# EAGLE board Main (EAGLE 8.7.0), part 1 of 2
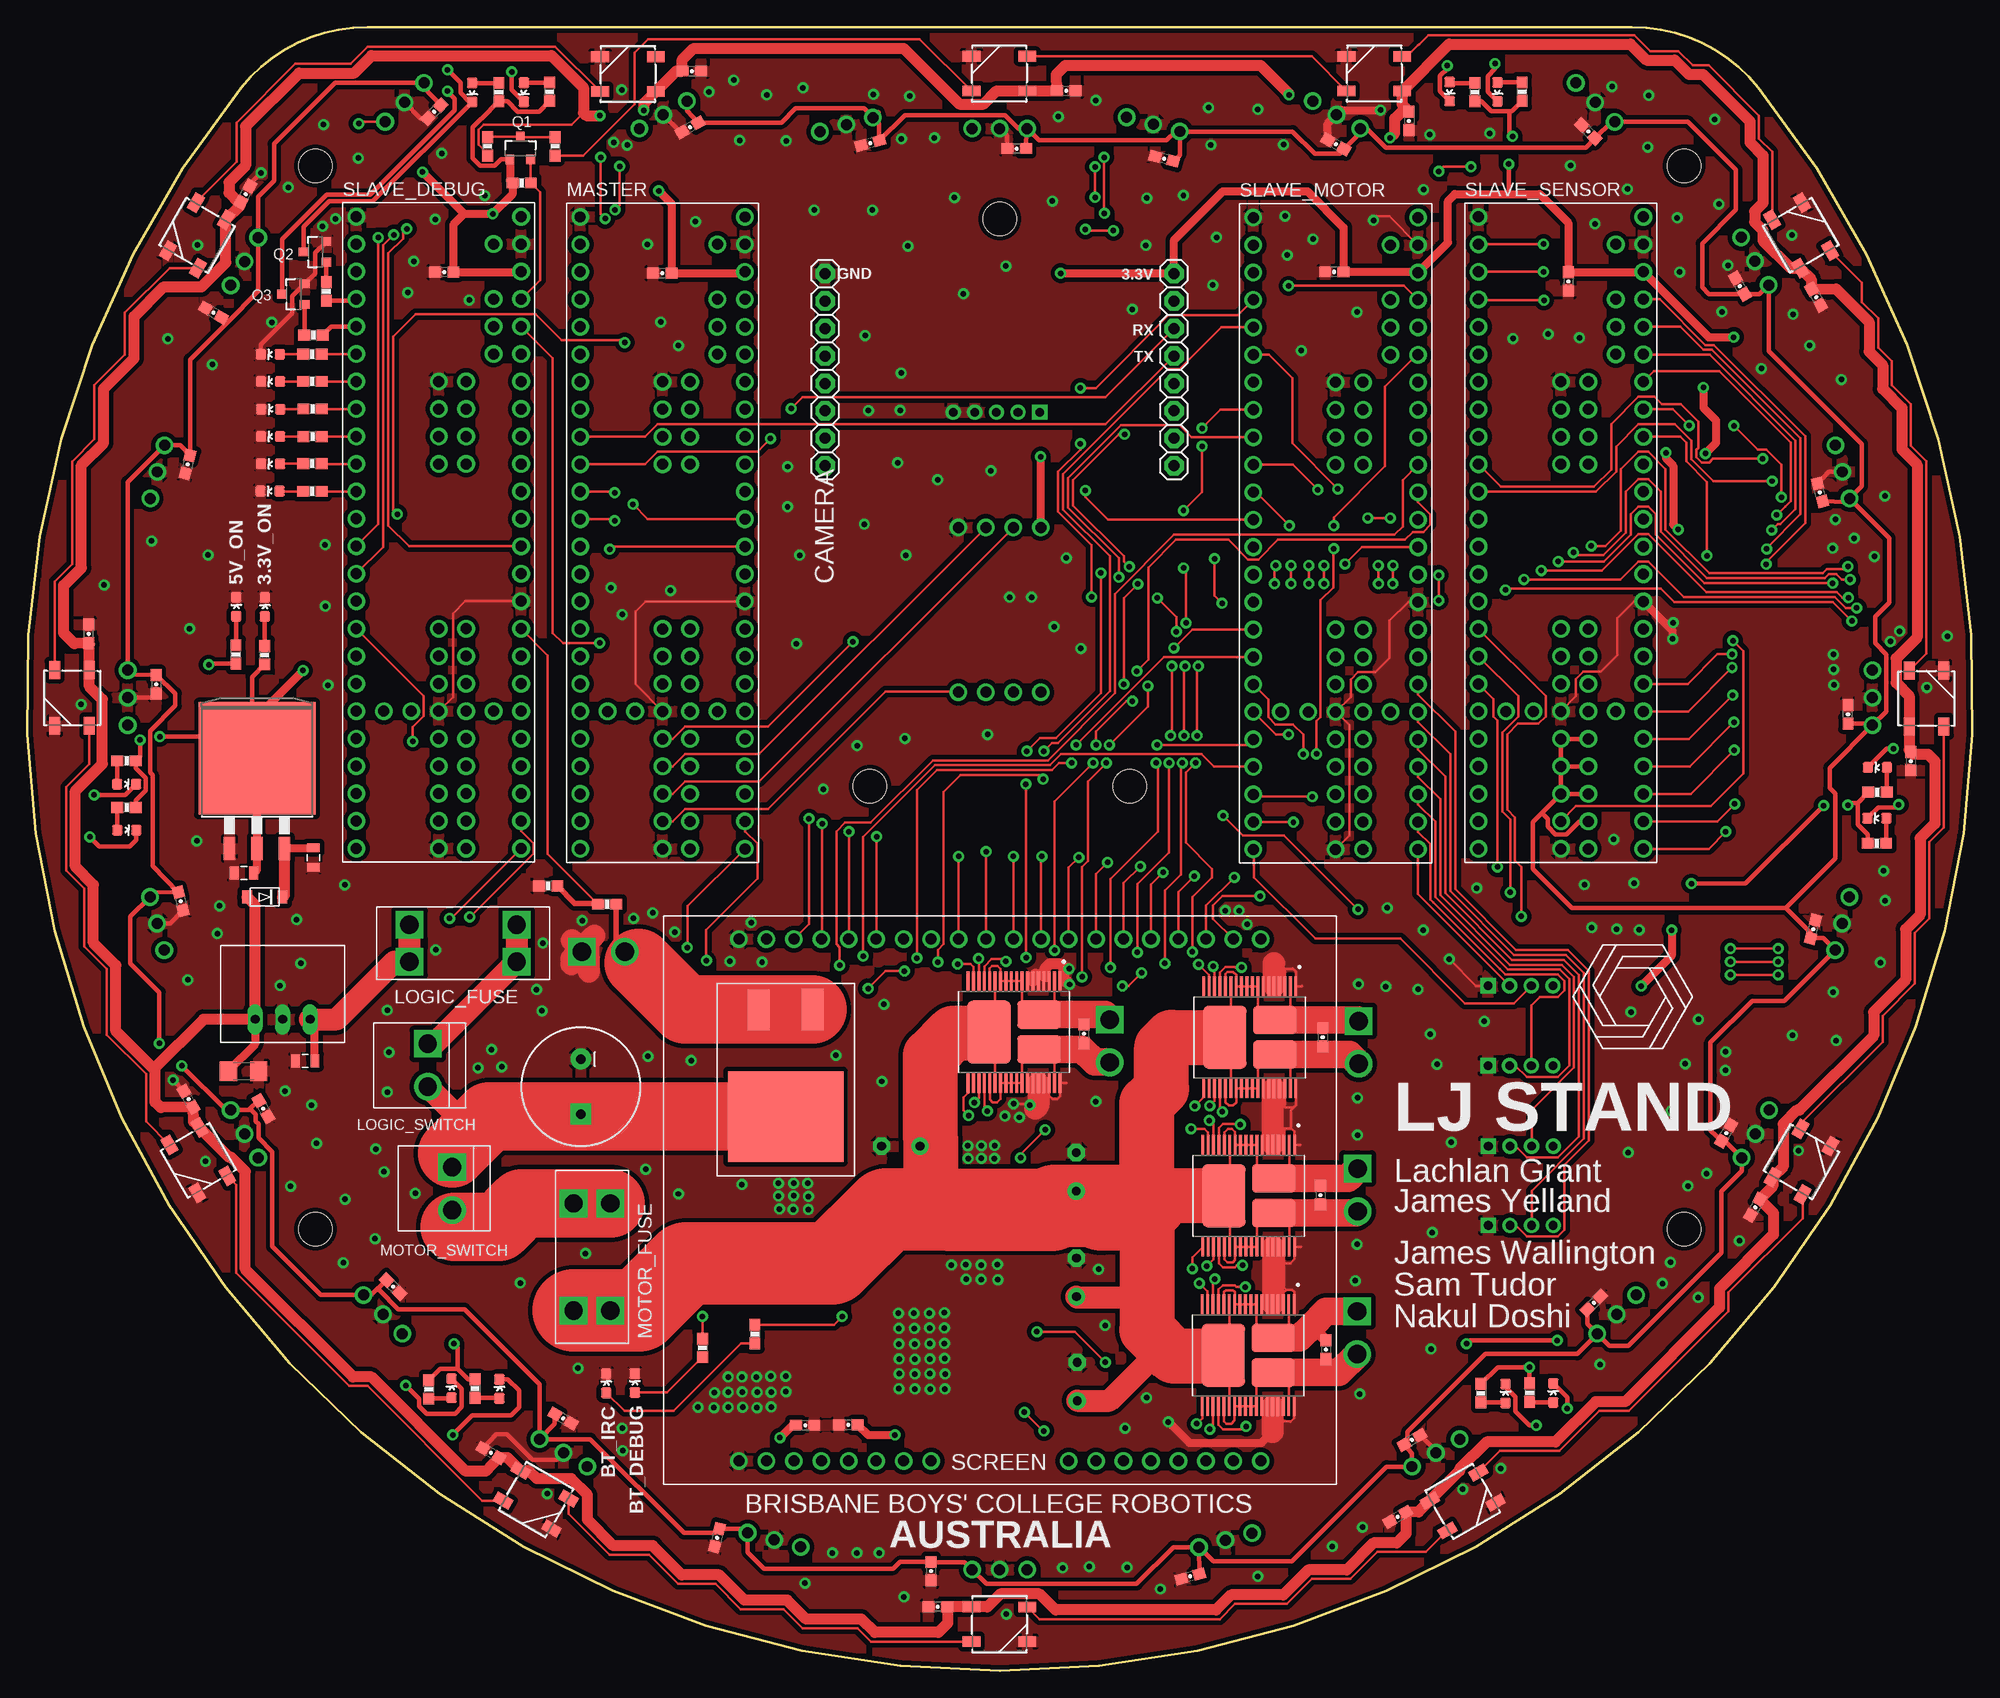
[diagram p5: board, top side]
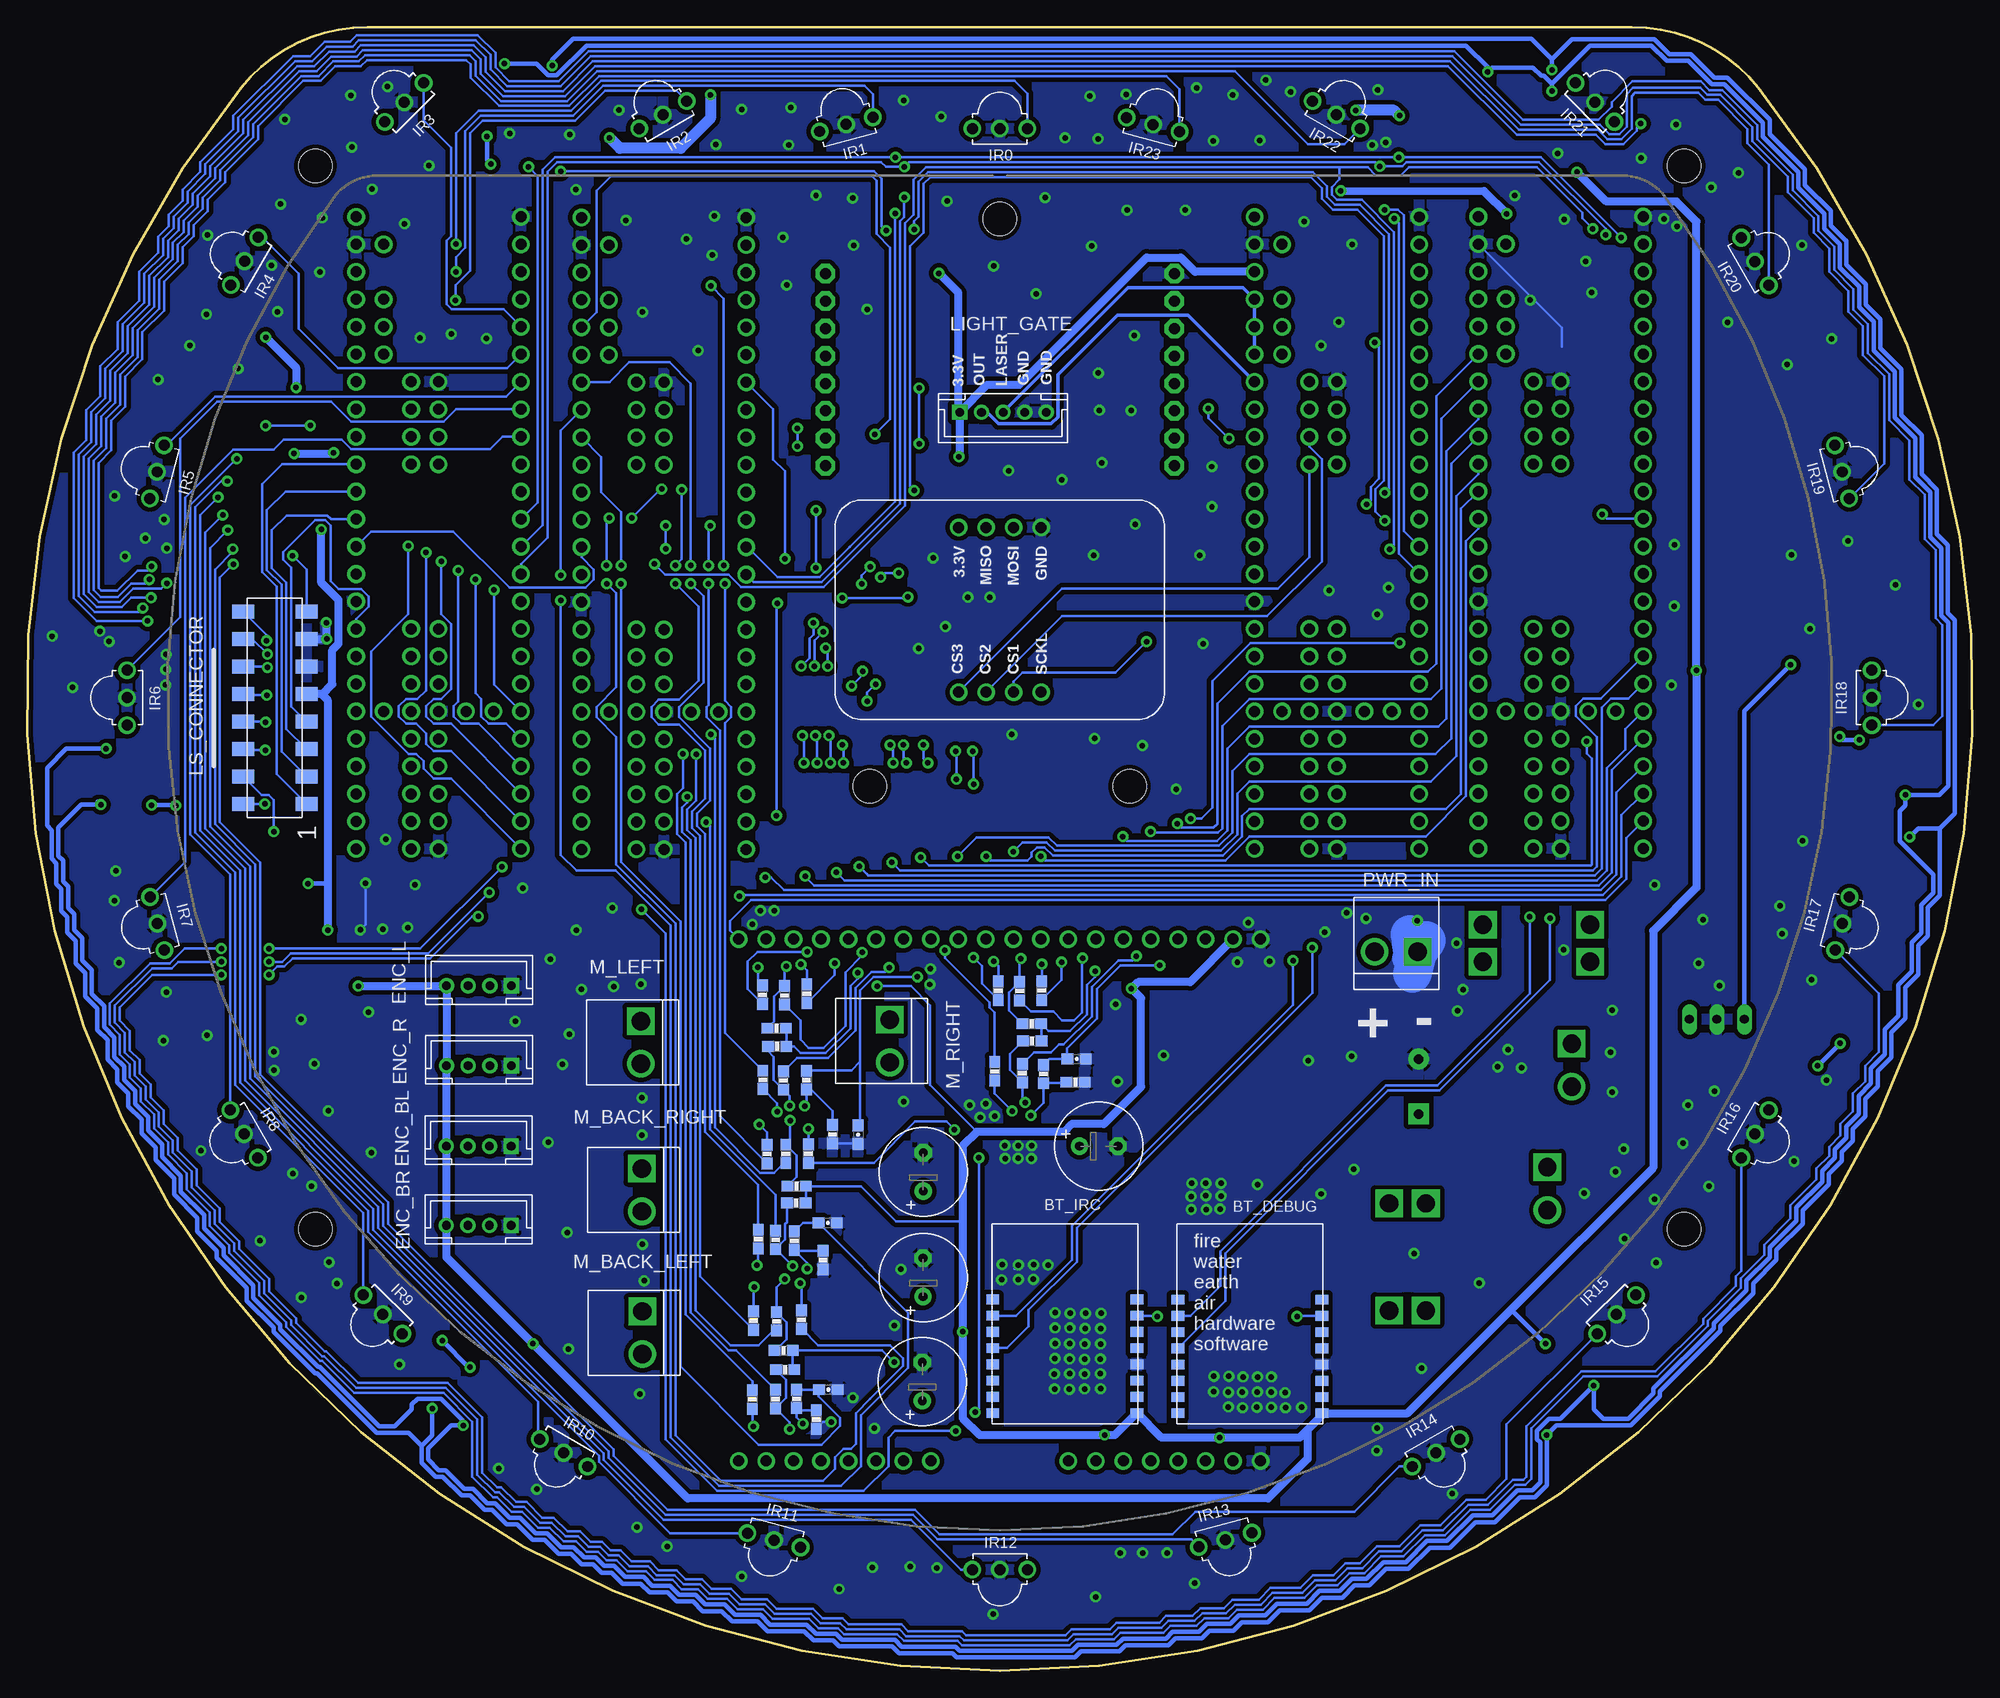
[diagram p6: board, bottom side, seen from below]

Size 179.87 x 152 mm. Coordinates in mm from the lower left corner, seen from the top.
Outline: 31.49,152 arc51 19.8,146.4 arc258 160.07,146.4 arc51 148.38,152 31.49,152
Copper layers (1*16): Top 0.035mm / dielectric 1.5mm / Bottom 0.035mm
Design rules "SparkFun *": minimum track width 8mil, minimum drill 20mil, track to track 8mil, track to pad 8mil, pad to pad 8mil, via to via 8mil, smd to smd 8mil, copper to edge 10mil, drill to drill 8mil, minimum pad ring 12mil, minimum via ring 10mil, stop-mask expansion 4mil, vias tented up to drill 25mil, thermal gap 10mil
Holes 3.1 mm at 26.65,139.14 77.93,81.8 153.22,139.14 26.65,40.86 153.22,40.86 89.93,134.25 101.93,81.8

## Footprints (pad centres in the part's own frame; a part is rotated, then mirrored left to right if it is on the bottom)
LED-0603 = smd 1 x 1: A 0,-0.877; C 0,0.877
HM-11 = smd 1.2 x 0.9: GND 7.508,-0.6; NC1 -5.808,-0.6; NC2 -5.808,-2.1; NC3 7.508,-3.6; NV1 -5.808,-3.6; NV2 -5.808,-5.1; PIO0 7.508,5.4; PIO1 7.508,3.9; PIO2 7.508,2.4; PIO3 7.508,0.9; RESETB 7.508,-2.1; UART_CTS -5.808,2.4; UART_RTS -5.808,5.4; UART_RX -5.808,0.9; UART_TX -5.808,3.9; VCC 7.508,-5.1
CPOL-RADIAL-1000UF-25V = drill 0.9 pad 1.93 square: + 2.54,0 | drill 0.9 pad 1.93: - -2.54,0
0805 = smd 0.8 x 1.2: 1 -0.9,0; 2 0.9,0
1206 = smd 1.6 x 1.8: 1 -1.4,0; 2 1.4,0
0603-CAP = smd 1.1 x 1: 1 -0.85,0; 2 0.85,0
E3,5-8 = drill 0.813 pad 1.6: + -1.778,0 | drill 0.813 pad 1.6 octagon: - 1.778,0
D2PAK(TO-263AB) = smd 2.032 x 3.81: A 2.5,-5.169; NOP -2.5,-5.205 | smd 10.66 x 8.38: C 0,4.7
SOD-123FL = smd 0.91 x 1.22: A 1.637,0; C -1.637,0
WS2812B = smd 1.651 x 1: 1 -2.577,1.6; 2 -2.577,-1.6; 3 2.577,-1.6; 4 2.577,1.6
B4B-PH-K-S = drill 0.8 square: 1 -3,0 | drill 0.8: 2 -1,0; 3 1,0; 4 3,0
TSSP58038 = drill 1.016: 1 2.54,0; 2 0,0; 3 -2.54,0
B5B-PH-K-S = drill 0.8 square: 1 -4,0 | drill 0.8: 2 -2,0; 3 0,0; 4 2,0; 5 4,0
3568-FUSEHOLDER = drill 1.702 square: 1 0,3.404; 2 0,0; 3 9.906,0; 4 9.906,3.404
B2P-VH = drill 1.7 square: 1 -1.98,0 | drill 1.7: 2 1.98,0
2X08_SMT = smd 1.27 x 2.032: 1 -8.89,-2.921; 2 -8.89,2.921; 3 -6.35,-2.921; 4 -6.35,2.921; 5 -3.81,-2.921; 6 -3.81,2.921; 7 -1.27,-2.921; 8 -1.27,2.921; 9 1.27,-2.921; 10 1.27,2.921; 11 3.81,-2.921; 12 3.81,2.921; 13 6.35,-2.921; 14 6.35,2.921; 15 8.89,-2.921; 16 8.89,2.921
TEENSY-3.5 = drill 1.016: 0 -7.62,26.67; 1 -7.62,24.13; 2 -7.62,21.59; 3 -7.62,19.05; 3.3V -7.62,-6.35; 3.3V-1 7.62,24.13; 3.3V-2 2.54,-29.21; 3.3V-3 -2.54,-16.51; 4 -7.62,16.51; 5 -7.62,13.97; 6 -7.62,11.43; 7 -7.62,8.89; 8 -7.62,6.35; 9 -7.62,3.81; 10 -7.62,1.27; 11 -7.62,-1.27; 12 -7.62,-3.81; 13 7.62,-3.81; 14 7.62,-1.27; 15 7.62,1.27; 16 7.62,3.81; 17 7.62,6.35; 18 7.62,8.89; 19 7.62,11.43; 20 7.62,13.97; 21 7.62,16.51; 22 7.62,19.05; 23 7.62,21.59; 24 -7.62,-8.89; 25 -7.62,-11.43; 26 -7.62,-13.97; 27 -7.62,-16.51; 28 -7.62,-19.05; 29 -7.62,-21.59; 30 -7.62,-24.13; 31 -7.62,-26.67; 32 -7.62,-29.21; 33 7.62,-29.21; 34 7.62,-26.67; 35 7.62,-24.13; 36 7.62,-21.59; 37 7.62,-19.05; 38 7.62,-16.51; 39 7.62,-13.97; 40 0,-8.89; 41 0,-11.43; 42 0,-13.97; 43 0,-19.05; 44 0,-21.59; 45 0,-24.13; 46 0,-26.67; 47 2.54,-26.67; 48 2.54,-24.13; 49 2.54,-21.59; 50 2.54,-19.05; 51 2.54,-13.97; 52 2.54,-11.43; 53 2.54,-8.89; 54 2.54,6.35; 55 2.54,8.89; 56 2.54,11.43; 57 2.54,13.97; A10 5.08,19.05; A11 5.08,16.51; AGND 7.62,26.67; AREF 5.08,21.59; DA0 7.62,-11.43; DA1 7.62,-8.89; DC 0,8.89; DD 0,6.35; DE 0,11.43; GND -7.62,29.21; GND-1 7.62,-6.35; GND-2 0,-29.21; GND-3 0,-16.51; GND-4 0,13.97; PRGRM 2.54,-16.51; RESET 5.08,-16.51; VBAT -5.08,-16.51; VIN 7.62,29.21; VUSB 5.08,26.67
SOP50P1030X247-36N = smd 1.79 x 0.35: 1 -4.715,4.25; 2 -4.715,3.75; 3 -4.715,3.25; 4 -4.715,2.75; 5 -4.715,2.25; 6 -4.715,1.75; 7 -4.715,1.25; 8 -4.715,0.75; 9 -4.715,0.25; 10 -4.715,-0.25; 11 -4.715,-0.75; 12 -4.715,-1.25; 13 -4.715,-1.75; 14 -4.715,-2.25; 15 -4.715,-2.75; 16 -4.715,-3.25; 17 -4.715,-3.75; 18 -4.715,-4.25; 19 4.715,-4.25; 20 4.715,-3.75; 21 4.715,-3.25; 22 4.715,-2.75; 23 4.715,-2.25; 24 4.715,-1.75; 25 4.715,-1.25; 26 4.715,-0.75; 27 4.715,-0.25; 28 4.715,0.25; 29 4.715,0.75; 30 4.715,1.25; 31 4.715,1.75; 32 4.715,2.25; 33 4.715,2.75; 34 4.715,3.25; 35 4.715,3.75; 36 4.715,4.25 | smd 5.8 x 4: SLUG1 0,-2.3 | smd 2.6 x 4: SLUG2 -1.6,2.3; SLUG3 1.6,2.3
SOT23-3 = smd 0.8 x 0.9: 1 -0.95,-1; 2 0.95,-1; 3 0,1.1
0603-RES = smd 1.1 x 1: 1 -0.85,0; 2 0.85,0
ADAFRUIT-2.4-TFT = drill 1.016: 3VO 7.62,2.54; C/D 10.16,50.8; CCS 48.26,2.54; CD 50.8,2.54; CLK 10.16,2.54; CS 17.78,2.54; CS_2 7.62,50.8; D0 33.02,50.8; D1 35.56,50.8; D2 38.1,50.8; D3 40.64,50.8; D4 43.18,50.8; D5 45.72,50.8; D6 48.26,50.8; D7 50.8,50.8; D/C 20.32,2.54; GND 2.54,2.54; GND_2 2.54,50.8; IM0 38.1,2.54; IM1 40.64,2.54; IM2 43.18,2.54; IM3 45.72,2.54; LITE_2 20.32,50.8; MISO 12.7,2.54; MOSI 15.24,2.54; RD 15.24,50.8; RST_2 17.78,50.8; VIN 5.08,2.54; VIN_2 5.08,50.8; WR 12.7,50.8; X+_2 22.86,50.8; X- 35.56,2.54; X-_2 27.94,50.8; Y+_2 25.4,50.8; Y- 33.02,2.54; Y-_2 30.48,50.8
OPENMV3 = drill 1.016 pad 1.778 octagon: 11 1.651,19.304; 12 1.651,16.764; 13 1.651,14.224; 14 1.651,11.684; 15 1.651,9.144; 16 1.651,6.604; 17 1.651,4.064; 18 1.651,1.524; 21 33.909,19.304; 22 33.909,16.764; 23 33.909,14.224; 24 33.909,11.684; 25 33.909,9.144; 26 33.909,6.604; 27 33.909,4.064; 28 33.909,1.524
GYRO = drill 1.016: 3.3V 3.81,-7.62; CS1 -1.27,7.62; CS2 1.27,7.62; CS3 3.81,7.62; GND -3.81,-7.62; MISO 1.27,-7.62; MOSI -1.27,-7.62; SCLK -3.81,7.62
TO263-3 = smd 1.067 x 2.159: 1 -2.54,-5.791; 2 0,-5.791; 3 2.54,-5.791 | smd 10.8 x 10.41: TAB 0,2.54
V78-2000 = drill 0.8 long: 1 -2.54,0; 2 0,0; 3 2.54,0

## Placement (x,y rotation side)
3.3V_ON  GREEN  [LED-0603]  21.98,98.37 0 top
5V_ON  GREEN  [LED-0603]  19.34,98.4 0 top
BT_DEBUG  HM-11  [HM-11]  67.66,28.93 0 bottom
BT_DEBUG_LED  BLUE  [LED-0603]  56.2,26.62 0 top
BT_IRC  HM-11  [HM-11]  84.77,28.95 0 bottom
BT_IRC_LED  BLUE  [LED-0603]  53.55,26.59 0 top
C1  1000uF  [CPOL-RADIAL-1000UF-25V]  51.21,54.03 270 top
C2  10uF  [0805]  25.72,56.41 180 top
C3  22uF  [1206]  20.02,55.46 0 top
C4  10uF  [0805]  26.48,75.21 270 top
C5  10uF  [0805]  20.05,73.76 180 top
C6  33nF  [0603-CAP]  103.02,49.58 270 bottom
C7  470uF  [E3,5-8]  80.78,48.52 0 bottom
C8  470uF  [E3,5-8]  97.02,36.39 90 bottom
C9  470uF  [E3,5-8]  97.1,26.76 90 bottom
C10  470uF  [E3,5-8]  97.01,46.14 90 bottom
C11  33nF  [0603-CAP]  82.84,56.59 0 bottom
C12  33nF  [0603-CAP]  105.78,26.02 0 bottom
C13  33nF  [0603-CAP]  105.86,41.44 0 bottom
C14  0.1uF  [0603-CAP]  38.57,129.34 180 top
C15  0.1uF  [0603-CAP]  142.5,128.47 270 top
C16  0.1uF  [0603-CAP]  58.74,129.23 180 top
C17  0.1uF  [0603-CAP]  120.87,129.36 180 top
C18  0.1uF  [0603-CAP]  75.93,22.75 180 top
C19  0.1uF  [0603-CAP]  71.94,22.73 0 top
C20  0.1uF  [0603-CAP]  119.79,58.58 270 top
C21  0.1uF  [0603-CAP]  97.71,58.9 270 top
C22  0.1uF  [0603-CAP]  119.57,43.98 270 top
C23  0.1uF  [0603-CAP]  120.09,29.72 270 top
C38  0.1uF  [0603-CAP]  91.5,140.77 180 top
C39  0.1uF  [0603-CAP]  105.14,139.83 165 top
C40  0.1uF  [0603-CAP]  121.02,141.15 150 top
C41  0.1uF  [0603-CAP]  144.36,142.34 135 top
C42  0.1uF  [0603-CAP]  158.38,128.04 120 top
C43  0.1uF  [0603-CAP]  165.77,108.97 105 top
C44  0.1uF  [0603-CAP]  168.36,88.47 90 top
C45  0.1uF  [0603-CAP]  165.14,68.58 75 top
C46  0.1uF  [0603-CAP]  157.11,49.73 60 top
C47  0.1uF  [0603-CAP]  144.87,34.04 45 top
C48  0.1uF  [0603-CAP]  128.05,21.36 30 top
C49  0.1uF  [0603-CAP]  107.55,8.74 195 top
C50  0.1uF  [0603-CAP]  83.58,9.22 270 top
C51  0.1uF  [0603-CAP]  63.79,12.32 255 top
C52  0.1uF  [0603-CAP]  49.57,23.34 330 top
C53  0.1uF  [0603-CAP]  33.84,35.53 315 top
C54  0.1uF  [0603-CAP]  21.85,51.99 300 top
C55  0.1uF  [0603-CAP]  14.21,71.17 285 top
C56  0.1uF  [0603-CAP]  11.95,91.24 270 top
C57  0.1uF  [0603-CAP]  14.84,111.56 255 top
C58  0.1uF  [0603-CAP]  17.23,125.59 150 top
C59  0.1uF  [0603-CAP]  37.65,144.17 225 top
C60  0.1uF  [0603-CAP]  61.3,142.72 210 top
C61  0.1uF  [0603-CAP]  77.96,141.27 195 top
C62  0.1uF  [0603-CAP]  20.19,136.55 60 top
C63  0.1uF  [0603-CAP]  165.42,127.03 300 top
C64  0.1uF  [0603-CAP]  61.48,147.93 0 top
C65  0.1uF  [0603-CAP]  127.77,143.31 270 top
C66  0.1uF  [0603-CAP]  96.07,146.12 0 top
C67  0.1uF  [0603-CAP]  5.7,95.88 90 top
C68  0.1uF  [0603-CAP]  174.15,84.12 270 top
C69  0.1uF  [0603-CAP]  126.73,14.25 210 top
C70  0.1uF  [0603-CAP]  159.78,42.87 240 top
C71  0.1uF  [0603-CAP]  84.21,5.94 180 top
C72  0.1uF  [0603-CAP]  42.89,20.17 150 top
C73  0.1uF  [0603-CAP]  14.94,52.87 120 top
D1  [D2PAK(TO-263AB)]  70.14,55.96 180 top
D2  [SOD-123FL]  21.98,71.55 180 top
D3  [WS2812B]  89.9,147.7 180 top
D4  [WS2812B]  124.57,147.68 180 top
D5  [WS2812B]  164.02,132.74 120 top
D6  [WS2812B]  175.63,89.92 90 top
D7  [WS2812B]  164.07,47.09 60 top
D8  [WS2812B]  132.75,15.67 30 top
D9  [WS2812B]  89.9,4.32 0 top
D10  [WS2812B]  47.05,15.85 330 top
D11  [WS2812B]  15.83,47.22 300 top
D12  [WS2812B]  4.15,89.97 270 top
D13  [WS2812B]  15.71,132.74 240 top
D14  [WS2812B]  55.56,147.65 180 top
ENC_BL  [B4B-PH-K-S]  138.11,48.51 180 bottom
ENC_BR  [B4B-PH-K-S]  138.11,41.2 180 bottom
ENC_L  [B4B-PH-K-S]  138.09,63.35 180 bottom
ENC_R  [B4B-PH-K-S]  138.09,55.96 180 bottom
IR0  TSSP58038  [TSSP58038]  89.93,142.62 0 bottom
IR1  TSSP58038  [TSSP58038]  104.13,143 15 bottom
IR2  TSSP58038  [TSSP58038]  121.07,143.89 30 bottom
IR3  TSSP58038  [TSSP58038]  144.99,145.03 45 bottom
IR4  TSSP58038  [TSSP58038]  159.75,130.35 60 bottom
IR5  TSSP58038  [TSSP58038]  167.85,110.87 75 bottom
IR6  TSSP58038  [TSSP58038]  170.62,89.99 90 bottom
IR7  TSSP58038  [TSSP58038]  167.83,69.11 105 bottom
IR8  TSSP58038  [TSSP58038]  159.8,49.66 120 bottom
IR9  TSSP58038  [TSSP58038]  146.98,32.97 135 bottom
IR10  TSSP58038  [TSSP58038]  130.26,20.17 150 bottom
IR11  TSSP58038  [TSSP58038]  110.81,12.09 165 bottom
IR12  TSSP58038  [TSSP58038]  89.93,9.37 180 bottom
IR13  TSSP58038  [TSSP58038]  69.07,12.12 195 bottom
IR14  TSSP58038  [TSSP58038]  49.59,20.17 210 bottom
IR15  TSSP58038  [TSSP58038]  32.9,32.97 225 bottom
IR16  TSSP58038  [TSSP58038]  20.1,49.66 240 bottom
IR17  TSSP58038  [TSSP58038]  12.02,69.11 255 bottom
IR18  TSSP58038  [TSSP58038]  9.31,89.99 270 bottom
IR19  TSSP58038  [TSSP58038]  12.05,110.87 285 bottom
IR20  TSSP58038  [TSSP58038]  20.1,130.33 300 bottom
IR21  TSSP58038  [TSSP58038]  34.9,145.04 315 bottom
IR22  TSSP58038  [TSSP58038]  58.81,143.89 330 bottom
IR23  TSSP58038  [TSSP58038]  75.75,142.98 345 bottom
LED_DEBUG1  RED  [LED-0603]  22.49,121.74 90 top
LED_DEBUG2  GREEN  [LED-0603]  22.52,119.23 90 top
LED_DEBUG3  BLUE  [LED-0603]  22.54,116.66 90 top
LED_DEBUG4  ORANGE  [LED-0603]  22.52,114.15 90 top
LED_DEBUG5  YELLOW  [LED-0603]  22.52,111.61 90 top
LED_DEBUG6  WHITE  [LED-0603]  22.46,109.09 90 top
LEDA1  RED  [LED-0603]  41.16,145.95 180 top
LEDA2  RED  [LED-0603]  131.53,146.02 180 top
LEDA3  RED  [LED-0603]  171.08,83.54 90 top
LEDA4  RED  [LED-0603]  141.11,25.7 0 top
LEDA5  RED  [LED-0603]  43.67,26.09 0 top
LEDA6  RED  [LED-0603]  9.23,77.75 270 top
LEDD1  WHITE  [LED-0603]  45.93,145.97 180 top
LEDD2  WHITE  [LED-0603]  135.95,146 180 top
LEDD3  WHITE  [LED-0603]  171.03,78.84 90 top
LEDD4  WHITE  [LED-0603]  136.69,25.65 0 top
LEDD5  WHITE  [LED-0603]  39.25,26.14 0 top
LEDD6  WHITE  [LED-0603]  9.21,81.99 270 top
LIGHT_GATE  [B5B-PH-K-S]  89.63,116.38 0 bottom
LOGIC_FUSE  2A  [3568-FUSEHOLDER]  45.26,68.99 180 top
LOGIC_SWITCH  [B2P-VH]  37.04,56.01 270 top
LS_CONNECTOR  [2X08_SMT]  156.96,89.05 90 bottom
M_BACK_LEFT  [B2P-VH]  123,31.27 270 bottom
M_BACK_RIGHT  [B2P-VH]  123.02,44.47 270 bottom
M_LEFT  [B2P-VH]  123.12,58.11 270 bottom
M_RIGHT  [B2P-VH]  100.11,58.24 270 bottom
MASTER  TEENSY-3.5  [TEENSY-3.5]  58.76,105.23 0 top
MOTOR_FUSE  30A  [3568-FUSEHOLDER]  50.53,43.23 270 top
MOTOR_SWITCH  [B2P-VH]  39.3,44.6 270 top
P1  [SOP50P1030X247-36N]  113.05,58.59 270 top
P2  [SOP50P1030X247-36N]  91.25,59.08 270 top
P3  [SOP50P1030X247-36N]  112.9,29.19 270 top
P4  [SOP50P1030X247-36N]  112.95,43.94 270 top
PWR_IN  [B2P-VH]  53.27,66.5 180 bottom
Q1  200mA/50V  [SOT23-3]  45.6,140.77 0 top
Q2  [SOT23-3]  26.68,131.22 90 top
Q3  [SOT23-3]  24.67,127.3 90 top
R1  1M  [0603-RES]  53.63,70.89 180 top
R2  300K  [0603-RES]  48.19,72.58 180 top
R3  330  [0603-RES]  19.32,93.98 90 top
R4  330  [0603-RES]  21.98,93.93 90 top
R5  330  [0603-RES]  67.29,31.14 270 top
R6  330  [0603-RES]  62.44,29.87 270 top
R7  1K  [0603-RES]  111.86,62.52 90 bottom
R8  1K  [0603-RES]  111.83,54.65 270 bottom
R9  1K  [0603-RES]  107.77,62.62 90 bottom
R10  1K  [0603-RES]  109.83,62.47 270 bottom
R11  3.3K  [0603-RES]  110.52,57.76 0 bottom
R12  1K  [0603-RES]  109.92,54.59 90 bottom
R13  3.3K  [0603-RES]  110.57,59.43 0 bottom
R14  10K  [0603-RES]  107.79,54.63 270 bottom
R15  1K  [0603-RES]  105.41,49.62 270 bottom
R16  1K  [0603-RES]  90.07,62.9 90 bottom
R17  1K  [0603-RES]  90.4,55.45 270 bottom
R18  1K  [0603-RES]  86.05,62.91 90 bottom
R19  1K  [0603-RES]  88.1,62.86 270 bottom
R20  1K  [0603-RES]  87.85,55.27 90 bottom
R21  3.3K  [0603-RES]  86.94,58.24 0 bottom
R22  3.3K  [0603-RES]  86.97,59.84 0 bottom
R23  10K  [0603-RES]  85.89,55.2 270 bottom
R24  1K  [0603-RES]  82.93,54.43 0 bottom
R25  1K  [0603-RES]  112.69,32.39 90 bottom
R26  1K  [0603-RES]  112.81,25.1 270 bottom
R27  1K  [0603-RES]  108.27,32.47 90 bottom
R28  1K  [0603-RES]  110.58,32.33 270 bottom
R29  1K  [0603-RES]  110.65,25.14 90 bottom
R30  3.3K  [0603-RES]  109.78,27.86 0 bottom
R31  3.3K  [0603-RES]  109.92,29.64 0 bottom
R32  10K  [0603-RES]  108.72,25.16 270 bottom
R33  1K  [0603-RES]  106.9,23.24 270 bottom
R34  1K  [0603-RES]  111.44,47.79 90 bottom
R35  1K  [0603-RES]  112.26,39.92 270 bottom
R36  1K  [0603-RES]  107.63,47.82 90 bottom
R37  1K  [0603-RES]  109.72,47.82 270 bottom
R38  1K  [0603-RES]  110.67,39.85 90 bottom
R39  3.3K  [0603-RES]  108.76,43.28 0 bottom
R40  3.3K  [0603-RES]  108.72,44.82 0 bottom
R41  10K  [0603-RES]  108.93,39.78 270 bottom
R42  1K  [0603-RES]  106.27,37.99 270 bottom
R43  330  [0603-RES]  43.62,145.97 90 top
R44  330  [0603-RES]  133.87,145.97 90 top
R45  330  [0603-RES]  171.08,81.25 0 top
R46  330  [0603-RES]  138.92,25.73 270 top
R47  330  [0603-RES]  41.44,26.11 270 top
R48  330  [0603-RES]  9.21,79.83 180 top
R49  330  [0603-RES]  48.32,146.02 90 top
R50  330  [0603-RES]  138.24,146.02 90 top
R51  330  [0603-RES]  171.03,76.53 0 top
R52  330  [0603-RES]  134.43,25.68 270 top
R53  330  [0603-RES]  37.15,26.03 270 top
R54  330  [0603-RES]  9.21,84.15 180 top
R55  330  [0603-RES]  26.38,121.74 180 top
R56  330  [0603-RES]  26.38,119.23 180 top
R57  330  [0603-RES]  26.4,116.69 180 top
R58  330  [0603-RES]  26.4,114.12 180 top
R59  330  [0603-RES]  26.38,111.63 180 top
R60  330  [0603-RES]  26.38,109.07 180 top
R61  1K  [0603-RES]  27.67,127.56 90 top
R62  1K  [0603-RES]  26.47,123.5 180 top
R67  470  [0603-RES]  48.83,140.97 270 top
R68  10K  [0603-RES]  42.58,140.97 90 top
R69  10K  [0603-RES]  45.73,137.59 0 top
SCREEN  ADAFRUIT-2.4-TFT  [ADAFRUIT-2.4-TFT]  63.28,16.87 0 top
SLAVE_DEBUG  TEENSY-3.5  [TEENSY-3.5]  38.06,105.26 0 top
SLAVE_MOTOR  TEENSY-3.5  [TEENSY-3.5]  120.99,105.18 0 top
SLAVE_SENSOR  TEENSY-3.5  [TEENSY-3.5]  141.82,105.23 0 top
U$1  OPENMV3  [OPENMV3]  107.71,130.73 180 top
U$2  GYRO  [GYRO]  89.93,98.12 180 bottom
VREG-3.3  LM340S-05  [TO263-3]  21.27,81.84 0 top
VREG-5  V78-2000  [V78-2000]  23.63,60.25 180 top

## Tracks (layer width: path | path; a pad name or v marks a point on that pad's centre or on a via)
3.3V  (via drill 0.51)
  Top 0.254: 20.95,75.73 VREG-3.3.2 | v103.05,64.56 101.82,63.33 v101.26,63.33 | v99.71,28.55 96.89,31.37 v93.36,31.37 | v77.76,63.09 79.37,64.71 v81.13,64.71
  Top 0.406: R49.1 47.34,144.19 45.35,144.19 44.42,145.12 R43.1 42.01,143.51 42,143.51 41.22,142.73 41.22,139.86 41.91,139.16 43.25,139.16 43.85,139.77 Q1.1 | R51.1 170.18,77.33 169.25,78.26 169.25,80.27 | R45.1 169.25,80.27 | R44.1 134.46,145.12 135.37,144.22 137.04,144.22 | R50.1 137.28,144.22 137.04,144.22 | R48.1 10.06,80.48 10.99,81.41 10.99,82.57 10.06,83.5 R54.1 10.45,84.55 v10.45,86.08 | R47.1 40.79,26.96 39.83,27.92 | R53.1 38.18,27.92 39.83,27.92 | v12.28,86.38 19.26,86.38 20.81,84.84 | 20.81,84.84 VREG-3.3.TAB | R4.1 20.81,91.91 20.81,84.84 | 137.04,144.22 137.04,142.19 v137.35,141.88 | v136.99,139.32 136.99,136.58 137.02,136.55 | 169.25,80.27 168.57,80.27 v168.36,80.06 | v166.1,80.01 158.89,72.8 v153.88,72.8 | R46.1 v138.92,28.09 135.99,28.09 R52.1 | 39.83,27.92 39.83,29.9 v39.48,30.25 | v141.49,30.56 133.39,30.56 v133.08,30.25
  Top 0.762: v25.51,92.51 21.27,88.26 VREG-3.3.TAB VREG-3.3.2 21.27,74.08 C5.1 | Q1.1 44.65,137.82 R69.1 44.88,136.54 v43.06,134.72 40.42,134.72 | v95.57,129.23 106.03,129.23 U$1.18 106.06,132.31 110.55,136.8 118.39,136.8 121.72,133.47 C17.1 128.56,129.36 SLAVE_MOTOR.3.3V-1 131.38,132.08 131.38,135.91 132.01,136.55 137.02,136.55 139.86,136.55 142.5,133.91 C15.1 149.4,129.32 SLAVE_SENSOR.3.3V-1 155.48,123.32 v157.8,123.32 | 93.75,105.75 U$2.3.3V 93.74,112.25 v93.72,112.27 | v155,118.67 155,116.79 156.14,115.65 156.14,113.54 v155.18,112.57 | v151.52,112.65 151.52,112.12 152.21,111.44 152.21,106 v152.65,105.55 | v152.06,68.5 152.06,66.14 v149.24,63.32 | C18.1 77.76,21.82 v80.24,21.82 | v69.6,21.56 70.77,22.73 C19.1 | v36.56,138.58 40.42,134.72 | SLAVE_DEBUG.3.3V-1 45.63,129.34 C14.1 39.42,133.72 40.42,134.72 | v58.41,136.85 59.59,135.67 C16.1 66.25,129.23 MASTER.3.3V-1
  Bottom 0.254: R21.2 86.09,59.81 R22.2 85.44,59.16 83.42,59.16 81.87,60.7 81.87,63.42 81.13,64.17 v81.13,64.71 | R13.2 109.67,59.38 R11.2 108.98,57.76 108.37,57.15 106.02,57.15 103.74,59.43 103.74,63.32 103.05,64.02 v103.05,64.56 | v101.26,63.33 98.16,63.33 96.38,61.54 96.38,54.18 92.06,49.86 | R39.2 107.87,43.32 R40.2 102.75,44.82 99.5,41.58 93.53,41.58 93.36,41.4 | R30.2 109.07,28 R31.2 100.8,29.64 v99.71,28.55 | 93.46,31.47 v93.36,31.37
  Bottom 0.406: v10.45,86.08 11.98,86.08 v12.28,86.38 | v137.35,141.88 137.35,139.67 v136.99,139.32 | v168.36,80.06 166.15,80.06 v166.1,80.01 | v153.88,72.8 152.11,72.8 152.08,72.77 | v141.49,30.56 139.02,28.09 v138.92,28.09 | v39.48,30.25 42.62,33.39 42.62,33.44
  Bottom 0.762: v36.56,138.58 33.84,135.86 27.37,135.86 25.51,134.01 v25.51,92.51 25.51,72.44 29.53,68.43 29.53,46.53 42.62,33.44 52.22,23.83 BT_DEBUG.VCC 60.15,23.63 61.48,22.3 | v58.41,136.85 45.17,136.83 v43.06,134.72 | v95.57,129.23 93.75,127.42 93.75,116.5 | v157.8,123.32 155,120.52 v155,118.67 | v155.18,112.57 151.6,112.57 v151.52,112.65 | v152.65,105.55 152.65,100.62 151.06,99.03 151.06,94.97 151.65,94.39 151.65,91.24 152.59,90.3 | 152.59,90.3 152.61,90.32 LS_CONNECTOR.9 | SCREEN.VIN_2 72.32,63.7 77.15,63.7 v77.76,63.09 76.87,62.2 76.87,54 80.3,50.57 83.3,50.57 84.01,49.86 92.06,49.86 93.36,48.56 93.36,41.4 v93.36,31.37 93.36,23.37 91.81,21.82 v80.24,21.82 79.3,21.82 BT_IRC.VCC 74.97,21.56 v69.6,21.56 62.22,21.56 61.48,22.3 | 152.59,90.3 152.08,89.79 152.08,72.77 152.08,68.53 v152.06,68.5 | v149.24,63.32 142.26,63.32 141.11,63.32 ENC_L.4 ENC_R.4 141.11,55.93 ENC_BL.4 ENC_BR.4 141.11,38.28 v133.08,30.25 118.78,15.95 65.14,15.95 61.48,19.61 61.48,22.3 | v93.72,112.27 93.63,112.36 LIGHT_GATE.1 | MASTER.3.3V-1 71.87,129.36 73.19,130.68 76.37,130.68 | LIGHT_GATE.1 91.09,118.92 88.13,118.92 87.89,119.16 78.4,128.65 | 76.37,130.68 | 78.4,128.65 | 78.4,128.65 76.37,130.68 | LIGHT_GATE.1 93.75,116.5 | 93.75,116.5
5V  (via drill 0.51)
  Top 0.254: 21.08,60.24 VREG-5.3 | R68.1 42.58,140.3 41.75,141.13 41.75,142.51 42.22,142.98 50.35,142.98 51.45,144.08
  Top 0.406: v16.8,93.04 16.89,93.13 R3.1
  Top 0.508: D14.1 58.7,146.05 | 5.75,94.93 C67.1 | D6.1 174.15,87.21
  Top 0.762: VREG-5.3 21.09,57.94 C3.1
  Top 1.016: D2.A 21.09,70.8 VREG-5.3 16.31,60.25 11.73,55.66 | 11.73,55.66 | 11.73,55.66 8.21,59.17 8.21,65.24 6.13,67.33 6.13,72.69 4.46,74.36 4.46,81.36 6.96,83.87 6.96,89.82 5.75,91.03 D12.1 5.75,94.93 | C67.1 4.38,94.98 3.39,95.97 3.39,100.36 5.01,101.99 5.01,111.49 7.07,113.55 7.07,118.55 9.89,121.37 9.89,125.23 12.64,127.98 16.14,127.98 18.38,130.22 D13.1 19.74,135.53 C62.1 19.53,135.81 18.67,136.67 18.67,137.64 20.2,139.18 20.2,142.81 25.15,147.75 30.25,147.75 31.85,149.35 48.5,149.35 51.45,146.4 51.45,144.08 51.71,143.81 v52.97,143.81 | v57.03,144.3 57.03,144.53 57.03,144.95 D14.1 60.02,147.93 C64.1 60.58,148.98 61.64,150.04 81.05,150.04 86.2,144.88 88.44,144.88 89.65,146.1 D3.1 95.15,146.1 C66.1 95.17,147.63 96,148.46 114.04,148.46 116.67,145.83 v116.67,145.72 | v126.02,141.76 126.46,142.2 126.46,143.53 127.44,144.51 | C65.1 127.44,144.51 | 127.44,144.51 127.14,144.84 D4.1 131.48,150.41 148.26,150.41 149.73,148.95 152.34,148.95 153.66,147.62 154.95,147.62 159.29,143.28 159.29,141.33 160.51,140.12 160.51,135.72 159.74,134.95 159.74,133.97 160.51,133.2 160.51,132.26 163.06,129.71 D5.1 164.97,128.66 C63.1 167.23,127.8 170.32,124.72 170.32,122 171.56,120.76 171.56,118.55 173.34,116.77 173.34,112.96 174.76,111.54 174.76,95.56 172.81,93.61 172.81,91.37 174.03,90.16 D6.1 174.03,85.15 C68.1 174.41,84.76 175.74,84.76 176.39,84.12 176.39,78.35 175.04,77 175.04,69.92 173.7,68.57 173.7,63.9 170.72,60.93 170.72,58.71 163.86,51.85 163.64,51.85 162.36,50.58 162.36,46.63 D7.1 161.39,44.82 C70.1 161.47,42.34 161.47,40.34 156.47,35.35 156.47,33.6 147.77,24.89 145.03,24.89 141.32,21.18 134.96,21.18 132.45,18.68 132.45,18.5 D8.1 128.65,14.7 C69.1 127.51,14.63 127.51,12.71 126.64,11.84 124.5,11.84 122.02,9.35 118.46,9.35 116.15,7.04 111.32,7.04 109.92,5.64 95.09,5.64 93.6,7.13 90,7.13 88.79,5.92 D9.1 85.14,5.92 C71.1 85.11,5.89 85.11,4.42 84.25,3.56 78.39,3.56 77.14,4.8 72.04,4.8 70.28,6.55 66.32,6.55 63.98,8.89 60.53,8.89 57.84,11.58 54.21,11.58 51.81,13.98 51.81,16.28 50.32,17.77 47.14,17.77 46.38,18.52 D10.1 44.43,19.72 C72.1 42.42,18.47 40.56,18.47 31.85,27.18 30.15,27.18 20.18,37.15 20.18,46.18 18.85,47.51 18.67,47.51 D11.1 15.39,50.8 C73.1 12.37,52.09 11.85,52.61 11.85,55.54 11.73,55.66
  Bottom 0.406: VREG-5.3 21.09,88.75 v16.8,93.04
  Bottom 1.016: v52.97,143.81 53.46,144.3 v57.03,144.3 | v116.67,145.72 116.67,143.56 119.44,140.79 125.05,140.79 v126.02,141.76
BT_DEBUG_RX  (via drill 0.51)
  Top 0.254: SLAVE_DEBUG.34 45.68,77.66 46.82,76.52 46.82,75.57 40.97,69.72 v40.93,69.72
  Bottom 0.254: v40.93,69.72 40.93,62.66 49.46,54.13 54.21,54.13 69.53,38.81 69.53,35.61 72.31,32.83 BT_DEBUG.UART_TX
BT_DEBUG_TX  (via drill 0.51)
  Top 0.254: SLAVE_DEBUG.33 39.23,69.6 v39.05,69.6
  Bottom 0.254: v39.05,69.6 39.05,63.89 49.28,53.67 54.02,53.67 69.07,38.62 69.07,34.21 73.45,29.83 BT_DEBUG.UART_RX
BT_IRC_RX  (via drill 0.51)
  Top 0.254: MASTER.34 66.38,77.64 67.52,76.49 67.52,73.25 62.77,68.5 62.77,65.72 v62.81,65.68
  Bottom 0.254: BT_IRC.UART_TX 90.55,32.82 88.45,32.82 83.25,38.02 83.25,41.15 62.81,61.58 v62.81,65.68
BT_IRC_TX  (via drill 0.51)
  Top 0.254: MASTER.33 61.07,70.71 61.07,66.91 v61.05,66.88
  Bottom 0.254: BT_IRC.UART_RX 89.28,29.85 87.26,31.88 87.26,33.36 82.79,37.83 82.79,40.96 61.05,62.7 v61.05,66.88
CAM_RX
  Top 0.254: MASTER.7 57.14,114.12 58.29,115.26 99.73,115.26 U$1.15
CAM_TX  (via drill 0.51)
  Top 0.254: MASTER.8 57.14,111.58 58.29,112.72 67.52,112.72 v68.74,113.94 | v70.65,116.74 71.69,117.78 99.71,117.78 U$1.16
  Bottom 0.254: v68.74,113.94 70.65,115.85 v70.65,116.74
CS_DEBUG  (via drill 0.51)
  Top 0.254: MASTER.15 57.39,106.5 v56.02,107.87 | v55.26,122.83 55.03,123.06 49.41,123.06 47.03,125.45 35.93,125.45 33.84,123.37 33.84,107.34 v34.22,106.96
  Bottom 0.254: v56.02,107.87 55.64,108.25 55.64,109.48 54.87,110.24 54.87,122.45 v55.26,122.83 | v34.22,106.96 33.79,106.53 SLAVE_DEBUG.10
CS_MOTOR  (via drill 0.51)
  Top 0.254: SLAVE_MOTOR.10 99.96,106.45 97.85,108.56 v97.85,109.16 | v54.34,106.35 54.19,106.5 MASTER.10
  Bottom 0.254: v54.34,106.35 55.18,107.19 55.18,109.29 54.42,110.05 54.42,132.67 56.85,135.1 59.13,135.1 60.16,136.13 60.16,137.1 61.19,138.12 96.36,138.12 96.99,137.49 96.99,132.98 98.23,131.73 98.23,109.54 v97.85,109.16
CS_SENSOR  (via drill 0.51)
  Top 0.254: v133.51,139.06 130.93,139.06 v130.52,138.66 | v100.44,133.17 97.98,133.17 v97.85,133.3 | v54.34,108.94 54.24,109.04 MASTER.9
  Bottom 0.254: SLAVE_SENSOR.10 132.67,108.03 132.67,138.23 v133.51,139.06 | v130.52,138.66 101.56,138.66 100.87,137.97 100.87,133.6 v100.44,133.17 | v97.85,133.3 97.85,134.05 97.45,134.45 97.45,137.68 96.54,138.58 61,138.58 59.7,137.29 59.7,136.32 58.94,135.56 56.66,135.56 53.96,132.86 53.96,109.32 v54.34,108.94
GND  (via drill 0.51)
  Top 0.254: P3.31 P3.30 P3.34 | P3.33 P3.34 | P3.34 116.06,24.38 116.06,23.06 116.77,23.06 116.83,23.01 117.15,23.34 P3.36 | P4.33 P4.34 116.2,37.7 | 117.79,39.19 117.24,39.19 P4.36 117.2,38.09 116.8,37.69 116.2,37.69 | 116.2,37.7 116.11,37.62 | P1.7 P1.6 P1.5 P1.4 P1.3 116.3,64.92 | 117.89,63.32 117.87,63.3 P1.1 117.3,64.68 117,64.97 116.95,64.92 116.3,64.92 | 116.3,64.92 116.27,64.95 | P1.30 P1.31 | P1.32 P1.33 P1.34 116.3,52.38 116.19,52.27 116.37,52.09 117.1,52.09 | 117.74,48.64 117.72,48.66 P4.1 117.2,49.86 116.85,50.22 | P2.30 P2.31 P2.32 P2.33 | P2.33 P2.34 94.5,53.18 94.8,52.88 95.26,52.88 95.51,53.14 P2.36 | P2.36 | P2.36 96.11,54.36 96.12,54.36 | P2.33 94,52.95 93.99,52.93 | P3.7 P3.6 | P3.4 P3.3 | P3.3 116.15,34.99 116.42,35.25 | 116.42,35.25 116.95,35.25 117.16,35.05 P3.1 | 116.2,37.7 116.2,37.69 | 116.2,37.69 116.2,37.41 | 116.2,37.41 116.2,35.47 116.42,35.25 | P4.31 P4.30 116.01,37.41 116.2,37.41 | P4.7 P4.6 P4.5 P4.4 P4.3 116.24,48.7 116.24,50.16 116.8,50.16 116.85,50.22 | P1.36 117.3,52.29 117.1,52.09 | 116.85,50.22 116.85,51.84 117.1,52.09 | P2.3 94.5,64.8 94.72,65.02 95.36,65.02 95.5,64.87 P2.1 | P2.4 P2.3 | P2.7 P2.6 | v91.22,52.45 92.59,52.45 v92.72,52.32 | SLAVE_DEBUG.GND-3 39.38,90.07 39.38,97.76 40.52,98.91 SLAVE_DEBUG.GND-1 | SLAVE_SENSOR.GND-3 143.22,90.12 143.22,91.74 143.89,92.4 145.5,92.4 147.03,93.93 147.03,97.36 148.55,98.88 SLAVE_SENSOR.GND-1 | SLAVE_MOTOR.GND-1 127.7,98.83 125.97,97.1 125.97,93.65 124.67,92.35 123.06,92.35 122.39,91.68 122.39,90.07 SLAVE_MOTOR.GND-3 121.07,88.67 122.29,87.45 122.29,77.27 SLAVE_MOTOR.GND-2 | v131.51,65.81 133.97,63.35 ENC_L.1 | SLAVE_MOTOR.AGND 125.94,134.52 124.47,134.52
  Top 0.254: MASTER.GND-3 56.25,91.24 56.25,97.94 57.19,98.88 MASTER.GND-1 | P2.3
  Top 0.406: IR18.2 11.6,89.99 C56.2 | Q2.2 26.63,131.12 26.63,129.21 Q3.2 24.52,127.1 24.52,125.55 21.61,122.64 LED_DEBUG1.C | IR21.2 36.41,143.53 C59.2 | C48.2 130.26,20.38 IR10.2 | IR22.2 60.43,142.27 C60.2 | IR0.2 90.6,141.95 C38.2 | C43.2 166.57,110.87 IR5.2 | IR17.2 13.25,69.11 C55.2 | IR14.2 48.96,19.53 46.75,19.53 44.41,21.87 43.36,21.87 C72.2 | C62.2 20.64,137.52 v21.64,138.51 | C73.2 14.49,53.65 v13.51,54.62
  Top 0.762: v152.16,95.43 152.16,96.16 SLAVE_SENSOR.GND-1 | C40.2 120.24,143.06 IR2.2 121.5,144.32 v125.13,144.32 | v105.52,23.01 107.45,21.08 114.13,21.08 115.15,22.1
  Top 1.016: P2.6 93,64.19 93.23,64.41 93.89,64.41 | 93.89,64.41 94.12,64.19 | 95.89,64.96 95.45,65.4 94.56,65.4 94.12,64.96 94.12,64.64 93.89,64.41 | 95.89,64.96 95.89,63.79 96.08,63.79 v96.4,63.47 | v96.35,64.92 96.32,64.96 95.89,64.96
  Top 2.032: P3.32 115.15,22.1 | P4.32 115.2,33.95 P3.5 | P4.5 115.2,53.78 P1.32 | P1.5 115.3,65.44 115.28,65.46 | P2.32 93.5,52.27 93.2,51.97 | 51.93,65.86 PWR_IN.1 51.29,66.65 50.39,67.56 | 51.93,65.86 51.93,64.67 | 51.93,65.86 51.93,67.45 | 51.93,67.45 52.45,67.97 | 51.93,67.45 50.34,65.86 50.34,65.33
  Bottom 0.254: R33.2 106.27,23.01 v105.52,23.01 | R15.2 103.12,48.77 C6.2 | 88.45,37.16 88.58,37.16 | SLAVE_DEBUG.AGND 37.96,124.21 37.96,122.43 | v148.58,72.85 148.58,69.01 v149.06,68.53
  Bottom 0.762: LS_CONNECTOR.13 152.18,95.4 v152.16,95.43 152.16,96.88 v152.21,96.93
  Bottom 2.54: PWR_IN.1 52.42,67.41 52.25,66.35 52.36,65.9
  Bottom 3.556: PWR_IN.1 52.03,68.1 | PWR_IN.1 51.79,64.5 | PWR_IN.1 50.49,67.55
  other vias: 103.52,25.27 99.68,31.95 98.82,52.65 87.01,47.39 88.24,48.55 79.03,54.51 88.25,47.4 87,48.56 89.45,48.57 89.45,47.38 90.41,51.31 91.76,51.18 67.5,25.78 66.1,27.18 67.45,27.18 68.75,27.24 68.79,25.78 66.13,25.81 66.18,24.38 67.49,24.35 68.79,24.4 83.44,33.07 84.82,33.11 83.46,31.71 84.81,31.72 83.48,30.25 84.81,30.27 83.47,28.85 84.84,28.88 83.47,27.48 84.9,27.46 48.09,16.38 16.5,47.12 4.99,89.36 15.76,131.85 24.17,137.19 35.75,130.35 37.73,134.22 35.2,127.45 90.55,5.26 81.06,6.86 123.49,13.28 132.75,16.81 54.98,146.2 63.05,146 129.7,142.06 116.32,134.52 116.52,130.91 122.97,125.65 117.82,122.1 167.02,93.98 167.04,92.61 167.07,91.16 145.43,28.35 151.95,37.8 158.33,39.78 153.55,44.83 155.31,46 151.22,35.81 167.27,58.29 163.23,58.78 166.99,62.76 171.36,65.51 171.81,71.22 171.66,73.99 175.65,90.93 144,72.69 144.66,68.73 163.79,48.11 125.77,70.56 163.18,132.77 163.28,125.45 137.4,123.19 143.55,123.27 140.65,123.62 106.92,136.45 103.54,136.19 103.44,131.83 102.2,125.91 68.39,145.72 81.6,145.62 80.83,141.66 83.88,141.76 95.36,143.71 98.82,145.21 109.23,144.56 109.46,141.1 113.8,144.4 116.17,141.12 135.24,142.16 146.54,146.48 149.95,145.69 142.71,139.19 124.5,134.14 129.12,136.98 149.85,140.89 156.04,143.46 152.79,129.34 156.42,135.64 157.26,129.97 156.7,125.68 160.36,120.42 167.75,119.41 171.77,108.64 7.12,100.4 27.42,142.98 30.62,139.88 167.19,106.48 168.92,104.72 170.8,103.05 72.78,135.08 81.44,131.75 86.57,127.32 77.48,123.47 80.73,116.58 80.5,111.71 81.27,103.17 71.44,103.17 92.87,99.29 17.14,120.79 17.79,70.74 14.87,63.91 25.31,65.43 26.3,52.32 33.46,57.2 32.24,48.26 24.37,44.81 29.25,37.74 47.61,61.04 70.88,43.94 79.23,61.65 73.62,81.53 81.16,86.23 88.81,86.59 47.69,67.3 27.54,104.14 16.73,103.18 15.03,96.36 41.71,55.77 42.95,57.46 43.9,55.86 53.99,100.15 55.03,97.69 60.23,122.55 58.58,124.71 57.36,131.9 69.56,42.72 69.48,43.92 70.83,42.66 72.23,42.67 72.25,43.87 72.17,45.09 70.88,45.08 69.48,45.08 45.6,35.86 32.17,39.95 24.92,69.48 29.39,72.68 15.69,76.75 11.52,104.48 27.57,98.45 50.94,27.99 55.03,22.45 129.81,29.77 129.93,40.54 130.36,56.08 128.61,63.02 129.73,58.88 148.29,60.92 148.05,47.93 154.54,60.25 172.29,95.19 173.14,96.13 90.84,99.29 56.07,69.6 57.85,70.1 59.88,68.33 64.83,27.18 64.83,25.78 64.83,24.38 63.55,25.72 63.51,24.35 62.04,24.38 70.15,27.26 70.17,25.82 110.78,70.31 112.05,70.31 112.81,69.04 74.46,10.92 76.74,10.92 78.78,10.92 71.92,8.13 80.63,27.49 80.63,28.84 80.62,31.66 80.57,33.08 80.62,30.23 80.62,26.09 82.08,26.06 89.73,37.59 88.22,37.54 86.8,37.55 88.21,36.21 89.75,36.16 86.82,36.23 85.46,37.55 82,33.08 82.05,31.67 82.06,30.24 82.08,28.83 82.08,27.47 83.49,26.04 84.85,26.06 104.78,7.57 113.81,8.74 120.67,11.51 136.26,18.73 154.51,34.54 152.01,51.8 153.31,56.15 122.96,39.45 122.8,36.08 123.01,49.56 123.01,52.98 123.11,63.51 123.22,25.61 166.94,103.8 177.55,95.67 147.98,137.01 109.62,128.14 94.8,135.92 89.1,110.98 97.44,94.55 59.49,99.9 71.13,94.99 70.32,111.36 80.83,120 61.79,134 85.74,136.24 65.9,141.53 70.19,141.47 54.25,141.35 22.62,124.7 27.83,91.14 33,46.15 33.3,53.54 33.3,61.09 35.89,44.16 37.8,66.66 65.33,147.1 71.73,146.37 78.26,145.77 144.98,133.81 40.89,126.77 27.32,133.57 28.51,134.27 42.31,136.42 38.35,140.32 77.78,116.54 57.21,46.39 60.22,44.11 61.41,56.45 74.78,56.92 57.42,56.82 26.77,48.8 29.41,43.61 23.4,63.37 17.6,68.18 66.96,69.2 67.96,65.53 64.99,65.61 134.74,60.08 131.68,48.89 125.63,63.28 157.02,55.54 157.05,57.25 101.71,9.56 98.22,9.65 95.75,9.52 76.75,85.55 94.97,96.57 77.41,106.03 84.19,110.14 70.32,107.66 78.16,135.09 129.09,68.5 101.53,22.46 99.07,37.15 66.09,44.98 51.62,38.59 47.1,63.01 23.86,53.61 134.03,72.38 146.7,76.88 146.99,68.6 164.81,122.54 152.58,134.36 118.89,132.4 109.98,132.55 90.49,129.91 96.09,102.9 51.34,69.38 55.08,20.37 55.49,141.07 13.02,123.17
  pour Top (isolate 0.406): -14.77,156.03 -14.77,17.75 22.49,-19.51 148.19,-19.51 203.29,35.59 203.29,122.89 150.3,175.87 3.01,175.87 -12.71,160.15
  pour Bottom (isolate 0.406): -15.97,155.07 -15.97,47.45 37.43,-5.94 158.25,-5.94 160.39,-3.81 194.78,30.58 194.78,143.89 178.85,159.82 -13.83,159.82
GYRO_CS1  (via drill 0.51)
  Top 0.254: MASTER.43 59.68,86.18 60.83,87.32 68.51,87.32 v76.36,95.17
  Bottom 0.254: v76.36,95.17 79.23,92.3 87.82,92.3 88.66,91.46 U$2.CS1
GYRO_CS2
  Bottom 0.254: U$2.CS2 84.16,97.54 65.21,97.54 60.16,102.59 60.16,112.05 61.3,113.2 MASTER.55
GYRO_CS3
  Bottom 0.254: U$2.CS3 84.16,100.08 64.2,100.08 61.3,102.97 MASTER.54
GYRO_MISO
  Top 0.254: MASTER.45 59.68,81.1 60.83,82.24 67.7,82.24 U$2.MISO
GYRO_MOSI
  Top 0.254: MASTER.44 59.68,83.64 60.83,84.78 67.7,84.78 U$2.MOSI
GYRO_SCLK
  Top 0.254: MASTER.46 59.68,78.56 60.83,79.7 68.51,79.7 79.36,90.55 86.07,90.55 U$2.SCLK
IR0  (via drill 0.51)
  Top 0.254: v140.22,131.93 134.22,131.93 SLAVE_SENSOR.0
  Bottom 0.254: IR0.1 87.39,145.83 88.58,147.01 126.8,147.01 129.57,144.25 138.14,144.25 140.22,142.16 v140.22,131.93
IR1  (via drill 0.51)
  Top 0.254: v140.22,129.36 SLAVE_SENSOR.1
  Bottom 0.254: IR1.1 101.67,145.81 102.42,146.56 126.61,146.56 129.38,143.79 137.95,143.79 139.38,142.35 139.38,131.58 140.22,130.74 v140.22,129.36
IR2  (via drill 0.51)
  Top 0.254: v140.24,126.75 134.27,126.75 SLAVE_SENSOR.2
  Bottom 0.254: IR2.1 119.81,146.1 126.42,146.1 129.19,143.33 137.76,143.33 138.92,142.17 138.92,129.47 140.24,128.15 v140.24,126.75
IR3
  Bottom 0.254: IR3.1 143.2,143.36 140.68,140.84 140.68,132.66 141.08,132.25 141.08,126.4 140.59,125.91 135.82,125.91 SLAVE_SENSOR.3
IR4
  Bottom 0.254: SLAVE_SENSOR.4 135.49,120.45 151.09,120.45 154.77,124.13 154.77,129.21 158.12,132.55 IR4.1
IR5
  Bottom 0.254: SLAVE_SENSOR.5 135.57,117.83 162.47,117.83 166.98,113.32 IR5.1
IR6
  Bottom 0.254: SLAVE_SENSOR.6 140.2,116.66 141.35,115.52 149.91,115.52 151.77,117.37 162.28,117.37 165.69,113.96 165.69,97.46 IR6.1
IR7
  Bottom 0.254: IR7.1 165.24,74.81 165.24,108.51 160.82,112.93 157.06,112.93 156.14,113.84 150.78,113.84 149.91,112.98 137.04,112.98 135.9,114.12 SLAVE_SENSOR.7
IR8  (via drill 0.51)
  Top 0.254: SLAVE_SENSOR.8 136.28,109.5 144.88,109.5 146.47,111.09 146.47,115.31 148.97,117.8 150.48,117.8 151.16,117.12 152.89,117.12 154.51,115.5 154.51,113.09 154.34,112.92 154.34,112.23 154.83,111.73 155.53,111.73 155.88,112.09 v160.47,112.09 | SLAVE_SENSOR.8
  Bottom 0.254: IR8.1 161.07,73.63 164.78,77.34 164.78,107.78 v160.47,112.09
IR9  (via drill 0.51)
  Top 0.254: SLAVE_SENSOR.9 145.07,109.04 146.92,110.9 146.92,113.22 148.97,115.26 152.37,115.26 153.88,113.75 153.88,112.04 155.9,110.02 v161.36,110.02
  Bottom 0.254: IR9.1 148.77,42.36 160.62,54.2 160.62,73.82 164.32,77.53 164.32,107.59 161.54,110.37 161.36,110.19 v161.36,110.02
IR10  (via drill 0.51)
  Top 0.254: SLAVE_SENSOR.19 152.16,116.66 v153.67,115.15 | v157.82,115.14 160.03,112.93 160.82,112.93 162.22,111.53 v162.22,108.51
  Bottom 0.254: v153.67,115.15 153.68,115.14 v157.82,115.14 | IR10.1 132.62,21.6 132.62,24.89 148.31,40.58 148.31,42.55 160.16,54.39 160.16,74.01 163.87,77.72 163.87,79.98 163.87,80.09 163.87,106.86 v162.22,108.51
IR11  (via drill 0.51)
  Top 0.254: v161.76,106.88 162.55,107.68 162.56,107.68 163.05,108.17 163.05,113.59 156.46,120.18 150.42,120.18 SLAVE_SENSOR.20
  Bottom 0.254: IR11.1 120.4,12.75 127,19.34 127,19.91 147.86,40.77 147.86,42.74 159.7,54.58 159.7,74.2 163.41,77.91 163.41,105.23 v161.76,106.88
IR12  (via drill 0.51)
  Top 0.254: v161.3,105.49 161.86,106.04 162.11,106.04 163.51,107.45 163.51,113.78 155.6,121.69 149.49,121.69 SLAVE_SENSOR.21
  Bottom 0.254: IR12.1 93.53,9.37 98.16,13.99 121,13.99 126.54,19.53 126.54,20.1 147.4,40.96 147.4,42.93 159.24,54.77 159.24,74.39 162.95,78.1 162.95,103.83 v161.3,105.49
IR13  (via drill 0.51)
  Top 0.254: v160.84,103.73 160.84,103.84 163.97,106.97 163.97,113.97 155.79,122.15 155,122.15 152.87,124.28 SLAVE_SENSOR.22
  Bottom 0.254: v160.84,103.73 160.84,103.48 162.49,101.83 162.49,78.29 158.79,74.58 158.79,54.96 146.94,43.12 146.94,41.15 126.08,20.29 126.08,19.72 120.82,14.45 97.97,14.45 95.67,12.16 72.23,12.16 IR13.1
IR14  (via drill 0.51)
  Top 0.254: v160.8,102.34 160.8,102.51 164.42,106.13 164.42,114.16 155.98,122.61 155.19,122.61 150.97,126.82 SLAVE_SENSOR.23
  Bottom 0.254: v160.8,102.34 162.04,101.1 162.04,78.48 158.33,74.77 158.33,55.15 146.49,43.31 146.49,41.34 125.63,20.48 125.63,19.91 120.63,14.91 97.78,14.91 95.48,12.62 73.95,12.62 71.86,14.71 57.16,14.71 52.97,18.9 IR14.1
IR15  (via drill 0.51)
  Top 0.254: v161.91,64.36 v157.49,64.36 | v138.16,69.77 138.16,74.35 137.58,74.93 137.58,78.92 136.87,79.64 136.87,86.59 137.86,87.58 139.75,87.58 140.42,88.25 140.42,90.12 SLAVE_SENSOR.24
  Bottom 0.254: IR15.1 43.09,22.78 43.09,17.74 45.01,15.82 46.81,15.82 49.17,13.46 51.03,13.46 52.98,11.51 55.07,11.51 56.62,9.96 57.99,9.96 59.11,8.84 60.98,8.84 62.15,7.67 64.9,7.67 65.99,6.58 68.4,6.58 69.19,5.79 71.4,5.79 72.11,5.08 74.55,5.08 75.18,4.44 79.15,4.44 79.73,3.86 83.29,3.86 83.84,3.3 93.06,3.3 93.44,3.68 98.4,3.68 99.03,4.32 103.93,4.32 104.49,4.88 106.32,4.88 107.18,5.74 110.56,5.74 111.45,6.63 113.81,6.63 114.78,7.59 116.56,7.59 117.45,8.48 118.97,8.48 119.81,9.32 121.46,9.32 122.27,10.13 123.97,10.13 124.99,11.15 125.9,11.15 126.69,11.94 127.76,11.94 128.72,12.9 129.89,12.9 131.16,14.17 132.25,14.17 133.7,15.62 134.67,15.62 136.01,16.97 136.41,16.97 137.78,18.34 137.78,23.43 140.97,26.62 149.25,26.62 152.19,29.57 152.37,29.57 155,32.2 155,32.6 157.49,35.09 157.49,36.26 160.26,39.03 160.26,39.71 162.06,41.52 162.06,42.76 164.2,44.9 164.2,46.39 165.92,48.12 165.92,49.26 167.22,50.56 167.22,51.83 168.44,53.05 168.44,54.24 169.45,55.26 169.45,56.48 170.37,57.39 170.37,59.2 171.31,60.14 171.31,61.33 168.28,64.36 v161.91,64.36 | v157.49,64.36 156.73,65.12 156.09,65.12 155.33,65.88 142.58,65.88 138.7,69.77 v138.16,69.77
IR16  (via drill 0.51)
  Top 0.254: v161.91,65.58 v157.49,65.58 | v137.12,71.99 137.12,78.74 136.41,79.45 136.41,86.78 137.88,88.25 137.88,90.12 SLAVE_SENSOR.25
  Bottom 0.254: IR16.1 21.37,37.01 21.88,36.5 21.88,35.59 24.9,32.56 24.9,32.11 29.32,27.69 36.18,27.69 41.26,22.61 41.26,17.94 41.53,17.68 42.51,17.68 44.82,15.37 46.62,15.37 48.98,13 50.84,13 52.79,11.05 54.88,11.05 56.43,9.5 57.8,9.5 58.92,8.38 60.8,8.38 61.96,7.21 64.71,7.21 65.8,6.12 68.21,6.12 69,5.33 71.21,5.33 71.92,4.62 74.36,4.62 74.99,3.99 78.96,3.99 79.54,3.4 83.1,3.4 83.66,2.84 93.25,2.84 93.63,3.23 98.59,3.23 99.22,3.86 104.12,3.86 104.68,4.42 106.51,4.42 107.37,5.28 110.75,5.28 111.64,6.17 114,6.17 114.97,7.14 116.75,7.14 117.64,8.03 119.16,8.03 120,8.86 121.65,8.86 122.46,9.68 124.16,9.68 125.18,10.69 126.09,10.69 126.88,11.48 127.95,11.48 128.91,12.45 130.08,12.45 131.35,13.72 132.44,13.72 133.89,15.16 134.86,15.16 136.2,16.51 136.6,16.51 138.24,18.15 138.24,23.24 141.16,26.16 149.44,26.16 152.38,29.11 152.56,29.11 155.46,32.01 155.46,32.41 157.95,34.9 157.95,36.07 160.72,38.84 160.72,39.52 162.52,41.33 162.52,42.57 164.65,44.71 164.65,46.2 166.38,47.93 166.38,49.07 167.68,50.37 167.68,51.64 168.9,52.86 168.9,54.05 169.91,55.07 169.91,56.29 170.83,57.2 170.83,59.01 171.77,59.95 171.77,61.52 168.31,64.98 166.47,64.98 165.87,65.58 v161.91,65.58 | v157.49,65.58 156.28,65.58 155.51,66.34 142.77,66.34 v137.12,71.99
IR17  (via drill 0.51)
  Top 0.254: v135.95,74.35 135.95,87.89 135.6,88.25 135.6,89.86 SLAVE_SENSOR.26 | v161.91,66.8 v157.49,66.8
  Bottom 0.254: IR17.1 8.65,62.62 8.65,57.22 9.92,55.95 9.92,54.52 11.06,53.38 11.06,51.73 12.2,50.59 12.2,49.49 13.24,48.45 13.24,47.64 14.44,46.45 14.44,45.46 16.83,43.07 16.83,41.82 19.26,39.39 19.26,38.47 21.42,36.31 21.42,35.4 24.45,32.38 24.45,31.92 29.14,27.23 35.99,27.23 40.8,22.42 40.8,17.75 41.34,17.22 42.32,17.22 44.63,14.91 46.43,14.91 48.79,12.55 50.65,12.55 52.6,10.59 54.69,10.59 56.24,9.04 57.61,9.04 58.73,7.92 60.61,7.92 61.77,6.76 64.52,6.76 65.61,5.66 68.02,5.66 68.81,4.88 71.02,4.88 71.73,4.17 74.17,4.17 74.8,3.53 78.77,3.53 79.35,2.95 82.91,2.95 83.47,2.39 93.44,2.39 93.82,2.77 98.78,2.77 99.41,3.4 104.31,3.4 104.87,3.96 106.7,3.96 107.56,4.83 110.94,4.83 111.83,5.71 114.19,5.71 115.16,6.68 116.94,6.68 117.83,7.57 119.35,7.57 120.19,8.41 121.84,8.41 122.65,9.22 124.35,9.22 125.37,10.24 126.28,10.24 127.07,11.02 128.14,11.02 129.1,11.99 130.27,11.99 131.54,13.26 132.63,13.26 134.08,14.71 135.05,14.71 136.39,16.05 136.79,16.05 138.69,17.96 138.69,23.05 141.35,25.71 149.63,25.71 152.57,28.65 152.75,28.65 155.92,31.82 155.92,32.22 158.41,34.71 158.41,35.88 161.17,38.65 161.17,39.33 162.98,41.14 162.98,42.38 165.11,44.52 165.11,46.02 166.84,47.74 166.84,48.89 168.13,50.18 168.13,51.45 169.35,52.67 169.35,53.86 170.37,54.88 170.37,56.1 171.28,57.01 171.28,58.82 172.22,59.76 172.22,61.71 168.5,65.43 166.66,65.43 165.3,66.8 v161.91,66.8 | v135.95,74.35 143.5,66.8 v157.49,66.8
IR18  (via drill 0.51)
  Top 0.254: v168.72,97.08 166.96,98.83 152.31,98.83 151.06,100.08 136.82,100.08 v136.69,99.95
  Bottom 0.254: IR18.1 3.62,87.45 2.78,88.29 2.78,96.71 3.41,97.34 3.41,103.62 4.43,104.63 4.43,108.77 5.83,110.17 5.83,113.78 7.71,115.65 7.71,119.9 9.66,121.85 9.66,124.52 11.01,125.87 11.01,127.77 12.79,129.55 12.79,131.71 14.23,133.16 14.23,134.53 16.62,136.91 16.62,138.36 19.9,141.64 19.9,142.93 23.14,146.18 24.33,146.18 25.13,146.97 31.45,146.97 33.36,145.06 33.36,144.65 34.61,143.41 41.57,143.41 47.92,149.76 127.93,149.76 130.7,146.99 135.28,146.99 136.56,148.27 136.56,149.61 138.19,151.23 149.39,151.23 149.97,150.65 152.33,150.65 153.68,149.3 155.28,149.3 160.79,143.79 160.79,142.57 163.84,139.52 163.84,138.61 165.47,136.98 165.47,135.94 166.76,134.64 166.76,133.6 167.75,132.61 167.75,131.11 169.48,129.39 169.48,126.72 171.49,124.71 171.49,122.22 173.09,120.62 173.09,117.86 174.38,116.56 174.38,113.82 175.55,112.65 175.55,99.19 173.44,97.08 v168.72,97.08 | v136.69,99.95 136.69,91.21 SLAVE_SENSOR.27
IR19  (via drill 0.51)
  Top 0.254: v138.42,100.91 147.31,100.91 148.97,102.56 149.91,102.56 153.19,99.29 167.15,99.29 168.14,98.3 v169.17,98.3
  Bottom 0.254: IR19.1 8.16,111.65 8.16,119.71 10.12,121.66 10.12,124.33 11.47,125.68 11.47,127.58 13.24,129.36 13.24,131.52 14.69,132.97 14.69,134.34 17.08,136.73 17.08,138.17 20.36,141.45 20.36,142.75 23.33,145.72 24.52,145.72 25.17,146.37 31.41,146.37 31.96,145.81 31.96,142.77 32.63,142.1 33.58,142.1 34.43,142.95 41.75,142.95 48.1,149.3 127.75,149.3 130.51,146.53 135.47,146.53 137.02,148.08 137.02,149.42 138.38,150.77 149.2,150.77 149.78,150.19 152.15,150.19 153.49,148.84 155.09,148.84 160.34,143.6 160.34,142.38 163.38,139.33 163.38,138.42 165.01,136.79 165.01,135.75 166.3,134.46 166.3,133.41 167.3,132.42 167.3,130.92 169.02,129.2 169.02,126.53 171.03,124.52 171.03,122.03 172.63,120.43 172.63,117.67 173.92,116.37 173.92,113.63 175.09,112.46 175.09,99.38 173.63,97.92 169.55,97.92 v169.17,98.3 | v138.42,100.91 138.42,90.4 137.88,89.86 137.88,88.25 137.21,87.58 135.6,87.58 SLAVE_SENSOR.28
IR20  (via drill 0.51)
  Top 0.254: v168.39,99.24 167.85,99.24 167.34,99.75 155.27,99.75 149.91,105.1 148.97,105.1 145.61,101.75 v139.99,101.75
  Bottom 0.254: IR20.1 18.83,139.28 20.81,141.26 20.81,142.56 23.52,145.26 24.71,145.26 25.36,145.91 31.22,145.91 31.51,145.62 31.51,142.58 32.44,141.64 33.77,141.64 34.62,142.49 41.94,142.49 48.29,148.84 127.56,148.84 130.32,146.07 135.66,146.07 137.48,147.89 137.48,149.23 138.57,150.32 149.01,150.32 149.59,149.73 151.96,149.73 153.3,148.39 154.9,148.39 159.88,143.41 159.88,142.19 162.93,139.14 162.93,138.23 164.55,136.6 164.55,135.56 165.85,134.27 165.85,133.22 166.84,132.23 166.84,130.74 168.57,129.01 168.57,126.34 170.57,124.33 170.57,121.85 172.17,120.25 172.17,117.48 173.47,116.18 173.47,113.44 174.64,112.27 174.64,99.57 173.44,98.37 171.1,98.37 170.23,99.24 v168.39,99.24 | v139.99,101.75 139.99,89.63 140.42,89.2 140.42,88.25 139.75,87.58 138.14,87.58 SLAVE_SENSOR.29
IR21  (via drill 0.51)
  Top 0.254: v166.94,100.58 155.08,100.58 150.58,105.08 150.58,106.98 149.91,107.64 148.97,107.64 148.3,106.98 148.3,105.08 145.8,102.59 v141.56,102.59 | IR21.1 30.84,143.24 v30.67,143.08
  Bottom 0.254: v166.94,100.58 167.45,100.08 170.04,100.08 171.29,98.83 173.25,98.83 174.18,99.75 174.18,112.08 173.01,113.25 173.01,115.99 171.71,117.29 171.71,120.06 170.11,121.66 170.11,124.15 168.11,126.15 168.11,128.82 166.38,130.55 166.38,132.04 165.39,133.04 165.39,134.08 164.09,135.37 164.09,136.41 162.47,138.04 162.47,138.95 159.42,142 159.42,143.22 154.71,147.93 153.11,147.93 151.77,149.28 149.4,149.28 148.82,149.86 138.75,149.86 137.93,149.04 137.93,147.7 135.85,145.62 130.14,145.62 127.37,148.39 48.48,148.39 42.13,142.04 34.81,142.04 33.96,141.19 32.26,141.19 31.05,142.39 31.05,142.7 v30.67,143.08 | v141.56,102.59 141.56,97.7 140.68,96.82 140.68,90.79 141.6,89.86 142.29,89.86 142.96,89.2 142.96,88.25 142.29,87.58 140.68,87.58 SLAVE_SENSOR.30
IR22  (via drill 0.51)
  Top 0.254: v168.57,100.92 167.79,100.92 167.29,101.42 166.59,101.42 166.21,101.04 155.33,101.04 151.04,105.33 151.04,109.06 149.91,110.18 148.97,110.18 147.84,109.06 147.84,105.27 145.75,103.18 143.23,103.18 v142.99,103.43
  Bottom 0.254: v168.57,100.92 168.95,100.53 170.23,100.53 171.48,99.29 173.07,99.29 173.72,99.94 173.72,111.89 172.55,113.06 172.55,115.8 171.26,117.1 171.26,119.87 169.66,121.47 169.66,123.96 167.65,125.96 167.65,128.63 165.92,130.36 165.92,131.86 164.93,132.85 164.93,133.89 163.64,135.18 163.64,136.22 162.01,137.85 162.01,138.76 158.96,141.81 158.96,143.03 154.52,147.47 152.92,147.47 151.58,148.82 149.21,148.82 148.63,149.4 138.94,149.4 138.39,148.85 138.39,147.51 136.04,145.16 129.95,145.16 127.18,147.93 68.21,147.93 61.45,141.17 58.06,141.17 IR22.1 | v142.99,103.43 142.99,90.67 143.79,89.86 144.83,89.86 145.5,89.2 145.5,88.25 144.83,87.58 143.89,87.58 142.96,86.66 142.96,85.71 142.29,85.04 140.68,85.04 SLAVE_SENSOR.31
IR23  (via drill 0.51)
  Top 0.254: v144.61,104.02 145.94,104.02 147.38,105.46 147.38,111.14 148.97,112.72 149.91,112.72 151.5,111.14 151.5,105.52 155.52,101.5 166.02,101.5 166.4,101.88 168.11,101.88 v168.36,102.13
  Bottom 0.254: IR23.1 73.3,146.24 74.53,147.47 126.99,147.47 129.76,144.7 136.23,144.7 138.85,147.32 138.85,148.54 139.25,148.95 148.44,148.95 149.03,148.36 151.39,148.36 152.73,147.01 154.33,147.01 158.51,142.84 158.51,141.62 161.55,138.57 161.55,137.66 163.18,136.03 163.18,134.99 164.48,133.7 164.48,132.66 165.47,131.67 165.47,130.17 167.19,128.44 167.19,125.77 169.2,123.77 169.2,121.28 170.8,119.68 170.8,116.91 172.1,115.61 172.1,112.87 173.26,111.7 173.26,100.13 173.02,99.89 171.52,99.89 169.66,101.75 168.74,101.75 v168.36,102.13 | v144.61,104.02 144.61,97.7 148.04,94.28 148.04,88.25 144.58,84.78 143.89,84.78 143.22,84.12 143.22,83.42 142.29,82.5 140.68,82.5 SLAVE_SENSOR.32
IR_PWR  (via drill 0.51)
  Top 0.406: C38.1 92.4,142.55 IR0.3 | C43.1 168.19,108.1 IR5.3 | 108.35,11.48 IR11.3 108.38,11.41 C49.1 | C52.1 48.79,22.83 IR14.3 | C53.1 32.28,35.24 | 32.28,35.24 31.8,34.76 IR15.3 27.17,34.76 22.68,39.25 22.68,48 21.41,49.27 21.41,50.56 21.15,50.82 21.15,51.44 20.73,51.86 20.49,51.86 | C54.1 20.49,51.86 | 20.49,51.86 IR16.3 18.41,51.86 v14.31,55.96 | C59.1 36.7,146.4 IR21.3 28.48,146.84 22.85,141.2 22.85,137.79 21.37,136.32 IR20.3 21.37,127.56 18.49,124.68 | IR22.3 61.01,144.24 C60.1 69.75,143.17 71.05,144.47 77.37,144.47 IR23.3 | IR1.3 117,142.34 119.06,140.28 121.38,140.28 C40.1 123.27,142.24 IR2.3 123.86,142.62 125.64,140.84 144.13,140.84 C41.1 146.53,143.24 IR3.3 153.56,143.24 158.01,138.79 158.01,135.11 154.87,131.98 154.87,127.94 155.51,127.3 C42.1 160.17,127.3 IR4.3 161.02,122.05 169.63,113.44 169.63,109.54 IR5.3 | IR6.3 166.67,83.5 166.67,81.65 167.19,81.13 167.19,75.13 162.6,70.54 | IR9.3 146.28,30.07 148.04,30.07 156.63,38.66 156.63,44.32 158.53,46.23 IR8.3 157.04,48.95 C46.1 155.61,50 155.64,55.07 155.64,58.09 159.5,61.96 162.47,61.96 IR7.3 166.07,67.76 C45.1 164.9,68.23 162.6,70.54 | IR9.3 143.32,29.31 134.81,29.31 127.63,22.12 127.63,21.25 C48.1 128.06,20.12 IR10.3 128.05,18.89 125.69,18.89 116.97,10.16 109.67,10.16 108.35,11.48 | IR14.3 52.08,21.44 60.74,12.77 63.64,12.77 C51.1 66.25,13.14 IR13.3 66.62,10.99 68.16,9.45 80.09,9.45 80.72,10.08 C50.1 86.69,10.07 IR12.3 88.72,8.04 102.58,8.04 105.98,11.44 108.32,11.44 108.35,11.48 | IR14.3 47.39,26.51 40.45,33.45 34.33,33.45 32.53,35.24 32.28,35.24 | v12.23,58.04 12.23,62.74 9.56,65.4 9.56,69.76 IR17.3 11.84,72.04 C55.1 11.6,74.42 11.6,82.82 11.37,83.06 11.37,86.92 13.7,89.26 13.7,90.38 C56.1 9.7,92.14 IR18.3 9.31,109.92 IR19.3 14.18,113.32 C57.1 15.08,121.26 18.49,124.68
  Top 0.406: SLAVE_SENSOR.44 SLAVE_SENSOR.43 SLAVE_SENSOR.50 | SLAVE_SENSOR.44 SLAVE_SENSOR.45 | SLAVE_SENSOR.45 140.05,79.34 | 140.05,79.34 139.23,78.51 139.23,74.14 142.83,70.54 162.6,70.54 | IR1.3 106.58,140.16 C39.1 | IR1.3 106.19,142.34 105.37,141.53 93.56,141.53 IR0.3 | 78.72,144.14 IR23.3 | IR5.3 172.17,104.76 172.17,98.79 170.87,97.48 170.87,95.03 171.9,93.99 171.9,88.73 IR6.3 | IR0.3 91.66,142.62 90.44,143.84 81.16,143.84 C61.1 78.78,143.06 IR23.3 | 140.05,79.34 140.6,78.79 140.6,78.06 141.31,77.34 142.32,77.34 143.54,78.56 SLAVE_SENSOR.47 | SLAVE_SENSOR.45 SLAVE_SENSOR.48 | SLAVE_SENSOR.49 SLAVE_SENSOR.44 | C47.1 144.27,32.09 IR9.3 | C58.1 18.45,124.68 18.49,124.68 | IR6.3 170.46,87.62 C44.1
  Bottom 0.406: v14.31,55.96 v12.23,58.04
LED_A_CTRL
  Top 0.406: R61.1 30.3,126.71 SLAVE_DEBUG.2
LED_D_CTRL
  Top 0.406: R62.1 28.13,124.31 SLAVE_DEBUG.3
LED_DEBUG1
  Top 0.254: SLAVE_DEBUG.4 27.25,121.77 R55.1
LED_DEBUG2
  Top 0.254: SLAVE_DEBUG.5 R56.1
LED_DEBUG3
  Top 0.254: SLAVE_DEBUG.6 R57.1
LED_DEBUG4
  Top 0.254: SLAVE_DEBUG.7 27.28,114.15 R58.1
LED_DEBUG5
  Top 0.254: SLAVE_DEBUG.8 27.25,111.61 R59.1
LED_DEBUG6
  Top 0.254: SLAVE_DEBUG.9 R60.1
LIGHT_GATE_LASER
  Bottom 0.305: MASTER.21 MASTER.22 MASTER.23 67.45,127.89 73.26,127.89 73.28,127.91 78.1,127.91 LIGHT_GATE.3
LIGHT_GATE_OUT
  Bottom 0.305: MASTER.20 72.55,125.37 79.03,125.37 84.57,119.84 84.57,116.82 84.57,115.94 85.19,115.32 90.07,115.32 91.13,116.38 LIGHT_GATE.2
LS0